# Altium schematic sheet Overview.SchDoc: EWEMOS [1] Overview
size B; Author: Vojtěch Horčička; DrawnBy: Vojtěch Horčička; SheetNumber: 1; SheetTotal: 3
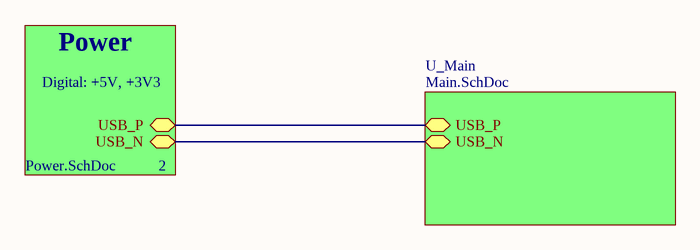
[diagram p0: Overview.SchDoc]

## Sub-sheets
Power = Power.SchDoc: USB_N (bidir), USB_P (bidir)
U_Main = Main.SchDoc: USB_P (bidir), USB_N (bidir)

## Nets
(unnamed): sheet U_Main/USB_P, sheet Power/USB_P
(unnamed): sheet U_Main/USB_N, sheet Power/USB_N

## Notes on the sheet
- Digital: +5V, +3V3
- Power
- 2